# Altium schematic sheet mx8m_pmic.SchDoc (part 3 of 3)
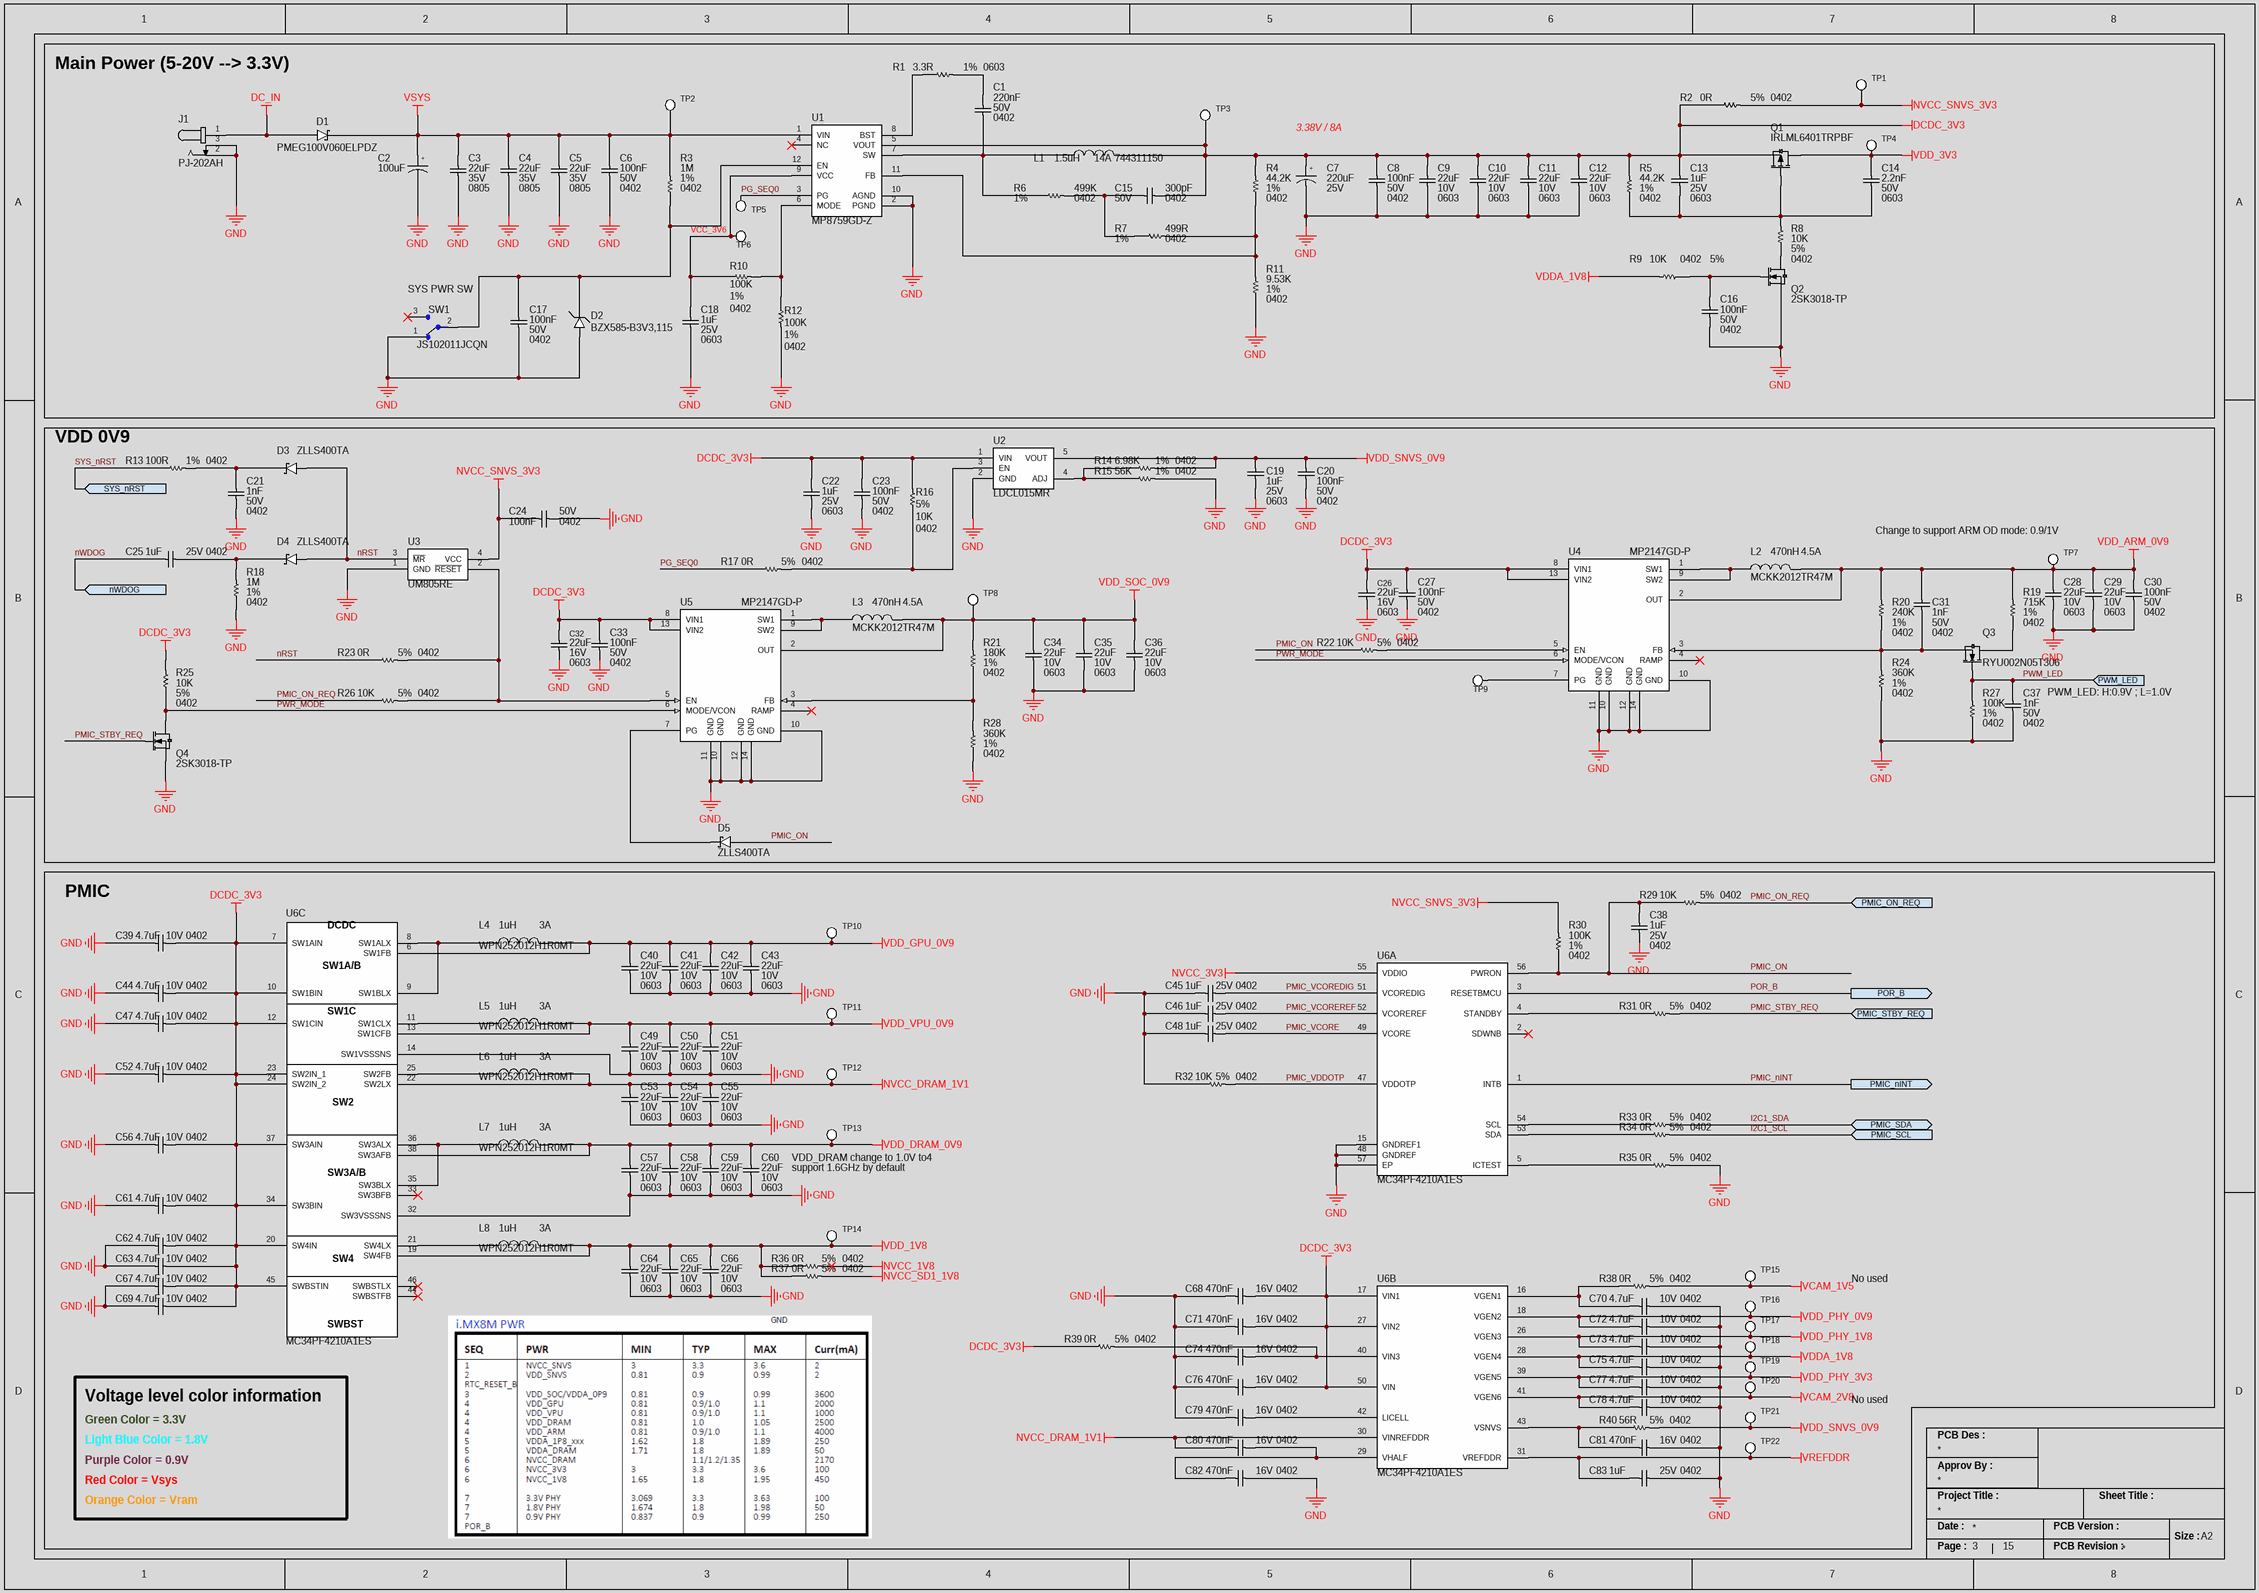
[diagram p2: mx8m_pmic.SchDoc]

## Library data of the parts (continued)
R6 = RES_499K_1%_100mW_0402: Res Thick Film 0402 499K Ohm 1% 0.1W ±100ppm/°C Molded SMD Punched Carrier T/R; Manufacturer: Panasonic; Power Rating: 100mW; Voltage Rating: 50V; Supplier 1: Digikey; Manufacturer Part Number: ERJ-2RKF4993X; RoHS: Yes; Category: Chip SMD Resistors; Stock 1: 791196; Pricing 1: 1=0.1, 10=0.024, 50=0.0152, 100=0.0125, 500=0.0084, 1000=0.0072, 5000=0.00523 (USD); Mount: Surface Mount; Number of Pins: 2; Case Code (Imperial): 0402; Case Code (Metric): 1005; Weight: 2.8E-05oz; Contact Plating: Tin; Min Operating Temperature: -55°C; Max Operating Temperature: 155°C; Packaging: Tape and Reel; Package Quantity: 1; Resistor Type: Thick Film; Termination: SMD/SMT; Number of Terminations: 2; Temperature Coefficient: 100ppm/°C; Max Power Dissipation: 100mW; Voltage Rating (DC): 50V; Features: Automotive AEC-Q200; Series: ERJ; Resistance Tolerance: 1%; Construction: Rectangular; Length: 1mm; Width: 0.5mm; Height: 0.016inch; Depth: 0.5mm; Military Standard: Not; Lead Free: Lead Free; RoHS Compliant: Yes; Reach SVHC Compliant: Unknown; ComponentLink1URL: https://datasheet.ciiva.com/5951/426256-5951322.pdf?src-supplier=Farnell; ComponentLink1Description: https://datasheet.ciiva.com/5951/426256-5951322.pdf?src-supplier=Farnell; ComponentLink2URL: https://datasheet.ciiva.com/43460/426256-43460346.pdf?src-supplier=Farnell; ComponentLink2Description: https://datasheet.ciiva.com/43460/426256-43460346.pdf?src-supplier=Farnell; ComponentLink3URL: https://datasheet.ciiva.com/9181/aoa0000ce2-9181509.pdf?src-supplier=Avnet; ComponentLink3Description: https://datasheet.ciiva.com/9181/aoa0000ce2-9181509.pdf?src-supplier=Avnet; ComponentLink4URL: https://datasheet.ciiva.com/9181/aoa0000ce2-9181513.pdf?src-supplier=Avnet; ComponentLink4Description: https://datasheet.ciiva.com/9181/aoa0000ce2-9181513.pdf?src-supplier=Avnet; ComponentLink5URL: https://datasheet.ciiva.com/16760/70260748-16760715.pdf?src-supplier=Allied+Electronics; ComponentLink5Description: https://datasheet.ciiva.com/16760/70260748-16760715.pdf?src-supplier=Allied+Electronics; ComponentLink6URL: https://datasheet.ciiva.com/28610/1678782-28610966.pdf?src-supplier=Element14; ComponentLink6Description: https://datasheet.ciiva.com/28610/1678782-28610966.pdf?src-supplier=Element14; ComponentLink7URL: https://datasheet.ciiva.com/28672/1678782-28672345.pdf?src-supplier=Element14; ComponentLink7Description: https://datasheet.ciiva.com/28672/1678782-28672345.pdf?src-supplier=Element14; ComponentLink8URL: https://datasheet.ciiva.com/46377/426256-46377753.pdf?src-supplier=Element14; ComponentLink8Description: https://datasheet.ciiva.com/46377/426256-46377753.pdf?src-supplier=Element14; Supplier Part Number 1: P499KLCT-ND
R7 = RES_499R_1%_100mW_0402: SMD Chip Resistor, 499 Ohm, ± 1%, 100 mW, 0402 [1005 Metric], Thick Film, Precision; Manufacturer: Panasonic; Power Rating: 100mW; Voltage Rating: 50V; Temperature Coefficient: 100ppm/°C; Supplier 1: Digi-Key; Manufacturer Part Number: ERJ-2RKF4990X; RoHS: Yes; Category: Chip SMD Resistors; Stock 1: 1881387; Pricing 1: 1=0.1, 10=0.024, 50=0.015, 100=0.0125, 500=0.00848, 1000=0.00731, 5000=0.00531 (USD); Mount: Surface Mount; Case Code (Metric): 1005; Case Code (Imperial): 0402; Contact Plating: Tin; Size Code: 0402; Min Operating Temperature: -55°C; Max Operating Temperature: 155°C; Packaging: Tape and Reel; Package Quantity: 1; Resistor Type: Thick Film; Number of Terminations: 2; Termination: SMD/SMT; Max Power Dissipation: 100mW; Voltage Rating (DC): 50V; Features: Automotive AEC-Q200; Series: ERJ; Resistance Tolerance: 1%; Technology: THICK FILM; Construction: Rectangular; Length: 1mm; Width: 0.5mm; Height: 0.35mm; Depth: 0.5mm; Reach SVHC Compliant: No; Lead Free: Lead Free; RoHS Compliant: Yes; Military Standard: Not; ComponentLink1URL: https://datasheet.ciiva.com/16766/70260748-16766015.pdf?src-supplier=Allied+Electronics; ComponentLink1Description: https://datasheet.ciiva.com/16766/70260748-16766015.pdf?src-supplier=Allied+Electronics; ComponentLink2URL: https://datasheet.ciiva.com/16765/70260748-16765054.pdf?src-supplier=Allied+Electronics; ComponentLink2Description: https://datasheet.ciiva.com/16765/70260748-16765054.pdf?src-supplier=Allied+Electronics; ComponentLink3URL: https://datasheet.ciiva.com/16508/aoa0000ce2-16508382.pdf?src-supplier=Future+Electronics; ComponentLink3Description: https://datasheet.ciiva.com/16508/aoa0000ce2-16508382.pdf?src-supplier=Future+Electronics; Supplier Part Number 1: P499LCT-ND
R8 R9 R16 R22 R25 R26 R29 R32 = RES_10K_5%_100mW_0402: Res Thick Film 0402 10K Ohm 5% 1/10W ±200ppm/°C Molded SMD Punched Carrier T/R; Manufacturer: Panasonic; Power Rating: 100mW; Voltage Rating: 50V; Supplier 1: Digi-Key; Manufacturer Part Number: ERJ-2GEJ103X; RoHS: Yes; Category: Chip SMD Resistors; Stock 1: 4696986; Pricing 1: 1=0.1, 10=0.021, 50=0.0132, 100=0.011, 500=0.00744, 1000=0.00639, 5000=0.00464 (USD); Mount: Surface Mount; Contact Plating: Tin; Case Code (Metric): 1005; Case Code (Imperial): 0402; Size Code: 0402; Min Operating Temperature: -55°C; Max Operating Temperature: 155°C; Temperature Coefficient: 200ppm/°C; Packaging: Cut Tape; Resistor Type: Thick Film; Package Quantity: 10000; Number of Terminations: 2; Termination: SMD/SMT; Max Power Dissipation: 100mW; Features: Automotive AEC-Q200; Series: ERJ; Resistance Tolerance: 5%; Technology: THICK FILM; Voltage Rating (DC): 50V; Length: 1mm; Width: 0.5mm; Height: 0.35mm; Depth: 0.5mm; Ratings: AEC-Q200; Radiation Hardening: No; Reach SVHC Compliant: No; RoHS Compliant: Yes; Lead Free: 5697LeadFree; ComponentLink1URL: https://datasheet.ciiva.com/27055/1935721-27055112.pdf?src-supplier=Jameco; ComponentLink1Description: https://datasheet.ciiva.com/27055/1935721-27055112.pdf?src-supplier=Jameco; ComponentLink2URL: https://datasheet.ciiva.com/11821/0900766b80f806dd-11821170.pdf?src-supplier=Rs; ComponentLink2Description: https://datasheet.ciiva.com/11821/0900766b80f806dd-11821170.pdf?src-supplier=Rs; ComponentLink3URL: https://datasheet.ciiva.com/43460/1678796-43460391.pdf?src-supplier=Farnell; ComponentLink3Description: https://datasheet.ciiva.com/43460/1678796-43460391.pdf?src-supplier=Farnell; ComponentLink4URL: https://datasheet.ciiva.com/22785/1678796-22785949.pdf?src-supplier=Farnell; ComponentLink4Description: https://datasheet.ciiva.com/22785/1678796-22785949.pdf?src-supplier=Farnell; ComponentLink5URL: https://datasheet.ciiva.com/46371/1678796-46371910.pdf?src-supplier=Element14; ComponentLink5Description: https://datasheet.ciiva.com/46371/1678796-46371910.pdf?src-supplier=Element14; ComponentLink6URL: https://datasheet.ciiva.com/28514/1678796-28514154.pdf?src-supplier=Element14; ComponentLink6Description: https://datasheet.ciiva.com/28514/1678796-28514154.pdf?src-supplier=Element14; ComponentLink7URL: https://datasheet.ciiva.com/24070/aoa0000ce1-37422-24070679.pdf?src-supplier=Mouser; ComponentLink7Description: https://datasheet.ciiva.com/24070/aoa0000ce1-37422-24070679.pdf?src-supplier=Mouser; ComponentLink8URL: https://datasheet.ciiva.com/16767/70260739-16767130.pdf?src-supplier=Allied+Electronics; ComponentLink8Description: https://datasheet.ciiva.com/16767/70260739-16767130.pdf?src-supplier=Allied+Electronics; ComponentLink9URL: https://datasheet.ciiva.com/16774/70260739-16774504.pdf?src-supplier=Allied+Electronics; ComponentLink9Description: https://datasheet.ciiva.com/16774/70260739-16774504.pdf?src-supplier=Allied+Electronics; ComponentLink10URL: https://datasheet.ciiva.com/9194/aoa0000ce1-9194140.pdf?src-supplier=Avnet; ComponentLink10Description: https://datasheet.ciiva.com/9194/aoa0000ce1-9194140.pdf?src-supplier=Avnet; Supplier Part Number 1: P10KJCT-ND
R10 R12 R27 R30 = RES_100K_1%_100mW_0402: SMD Chip Resistor, 100 kOhm, ± 1%, 63 mW, 0402 [1005 Metric], Thick Film, General Purpose; Manufacturer: Yageo; Temperature Coefficient: 100ppm/°C; Power Rating: 63mW; Voltage Rating: 50V; Supplier 1: Digi-Key; Manufacturer Part Number: RC0402FR-07100KL; RoHS: Yes; Category: Chip SMD Resistors; Stock 1: 27579413; Pricing 1: 1=0.1, 10=0.014, 50=0.0084, 100=0.007, 500=0.00464, 1000=0.00396, 5000=0.00282 (USD); Case Code (Metric): 1005; Case Code (Imperial): 0402; Min Operating Temperature: -55°C; Max Operating Temperature: 155°C; Resistor Type: Thick Film; Packaging: Tape and Reel; Package Quantity: 1; Number of Terminations: 2; Termination: SMD/SMT; Max Power Dissipation: 63mW; Features: Moisture Resistant; Series: RC; Resistance Tolerance: 1%; Construction: Rectangular; Technology: THICK FILM; Voltage Rating (AC): 50V; Length: 0.039inch; Width: 0.02inch; Height: 0.016inch; Depth: 0.5mm; Reach SVHC Compliant: No; RoHS Compliant: Yes; Lead Free: 5697LeadFree; Military Standard: Not; ComponentLink1URL: https://datasheet.ciiva.com/11819/0900766b80c66297-11819452.pdf?src-supplier=Rs; ComponentLink1Description: https://datasheet.ciiva.com/11819/0900766b80c66297-11819452.pdf?src-supplier=Rs; ComponentLink2URL: https://datasheet.ciiva.com/22747/1018594-22747509.pdf?src-supplier=Element14; ComponentLink2Description: https://datasheet.ciiva.com/22747/1018594-22747509.pdf?src-supplier=Element14; ComponentLink3URL: https://datasheet.ciiva.com/2453/pyu-r-int-thick-7-2453362.pdf?src-supplier=Digi-Key; ComponentLink3Description: https://datasheet.ciiva.com/2453/pyu-r-int-thick-7-2453362.pdf?src-supplier=Digi-Key; ComponentLink4URL: https://datasheet.ciiva.com/12667/pyu-rc0402-51-rohs-l-6-r-12667930.pdf?src-supplier=Mouser; ComponentLink4Description: https://datasheet.ciiva.com/12667/pyu-rc0402-51-rohs-l-6-r-12667930.pdf?src-supplier=Mouser; ComponentLink5URL: https://datasheet.ciiva.com/15189/getdatasheetpartid-323696-15189334.pdf?src-supplier=Verical; ComponentLink5Description: https://datasheet.ciiva.com/15189/getdatasheetpartid-323696-15189334.pdf?src-supplier=Verical; ComponentLink6URL: https://datasheet.ciiva.com/2453/pyu-r-int-thick-7-2453363.pdf?src-supplier=Digi-Key; ComponentLink6Description: https://datasheet.ciiva.com/2453/pyu-r-int-thick-7-2453363.pdf?src-supplier=Digi-Key; ComponentLink7URL: https://datasheet.ciiva.com/2453/pyu-r-int-thick-7-2453361.pdf?src-supplier=Digi-Key; ComponentLink7Description: https://datasheet.ciiva.com/2453/pyu-r-int-thick-7-2453361.pdf?src-supplier=Digi-Key; Supplier Part Number 1: 311-100KLRCT-ND
R11 = RES_9.53K_1%_100mW_0402: Res Thick Film 0402 9.53K Ohm 1% 1/10W ±100ppm/°C Molded SMD Punched Carrier T/R; Manufacturer: Panasonic; Power Rating: 100mW; Voltage Rating: 50V; Supplier 1: Digikey; Manufacturer Part Number: ERJ-2RKF9531X; RoHS: Yes; Category: Chip SMD Resistors; Stock 1: 73665; Pricing 1: 1=0.1, 10=0.024, 50=0.0152, 100=0.0125, 500=0.0084, 1000=0.0072, 5000=0.00523 (USD); Mount: Surface Mount; Case Code (Metric): 1005; Case Code (Imperial): 0402; Contact Plating: Tin; Min Operating Temperature: -55°C; Max Operating Temperature: 155°C; Packaging: Tape and Reel; Package Quantity: 10000; Resistor Type: Thick Film; Number of Terminations: 2; Termination: SMD/SMT; Temperature Coefficient: 100ppm/°C; Max Power Dissipation: 100mW; Voltage Rating (DC): 50V; Series: ERJ; Resistance Tolerance: 1%; Technology: THICK FILM; Features: Automotive AEC-Q200; Length: 1mm; Width: 0.5mm; Height: 0.35mm; Depth: 0.5mm; Ratings: AEC-Q200; Reach SVHC Compliant: Yes; Lead Free: Lead Free; RoHS Compliant: Yes; ComponentLink1URL: https://datasheet.ciiva.com/22764/1678782-22764822.pdf?src-supplier=Farnell; ComponentLink1Description: https://datasheet.ciiva.com/22764/1678782-22764822.pdf?src-supplier=Farnell; ComponentLink2URL: https://datasheet.ciiva.com/43467/1678782-43467400.pdf?src-supplier=Farnell; ComponentLink2Description: https://datasheet.ciiva.com/43467/1678782-43467400.pdf?src-supplier=Farnell; ComponentLink3URL: https://datasheet.ciiva.com/9194/aoa0000ce2-9194143.pdf?src-supplier=Avnet; ComponentLink3Description: https://datasheet.ciiva.com/9194/aoa0000ce2-9194143.pdf?src-supplier=Avnet; ComponentLink4URL: https://datasheet.ciiva.com/9194/aoa0000ce2-9194153.pdf?src-supplier=Avnet; ComponentLink4Description: https://datasheet.ciiva.com/9194/aoa0000ce2-9194153.pdf?src-supplier=Avnet; ComponentLink5URL: https://datasheet.ciiva.com/24026/aoa0000ce2-24026718.pdf?src-supplier=Mouser; ComponentLink5Description: https://datasheet.ciiva.com/24026/aoa0000ce2-24026718.pdf?src-supplier=Mouser; ComponentLink6URL: https://datasheet.ciiva.com/7829/1678782-7829317.pdf?src-supplier=Element14; ComponentLink6Description: https://datasheet.ciiva.com/7829/1678782-7829317.pdf?src-supplier=Element14; ComponentLink7URL: https://datasheet.ciiva.com/22668/1678782-22668670.pdf?src-supplier=Element14; ComponentLink7Description: https://datasheet.ciiva.com/22668/1678782-22668670.pdf?src-supplier=Element14; ComponentLink8URL: https://datasheet.ciiva.com/46373/1678782-46373013.pdf?src-supplier=Element14; ComponentLink8Description: https://datasheet.ciiva.com/46373/1678782-46373013.pdf?src-supplier=Element14; ComponentLink9URL: https://datasheet.ciiva.com/46373/1678782-46373014.pdf?src-supplier=Element14; ComponentLink9Description: https://datasheet.ciiva.com/46373/1678782-46373014.pdf?src-supplier=Element14; ComponentLink10URL: https://datasheet.ciiva.com/16786/70260748-16786262.pdf?src-supplier=Allied+Electronics; ComponentLink10Description: https://datasheet.ciiva.com/16786/70260748-16786262.pdf?src-supplier=Allied+Electronics; ComponentLink11URL: https://datasheet.ciiva.com/16788/70260748-16788696.pdf?src-supplier=Allied+Electronics; ComponentLink11Description: https://datasheet.ciiva.com/16788/70260748-16788696.pdf?src-supplier=Allied+Electronics; Supplier Part Number 1: P9.53KLDKR-ND
R13 = RES_100R_1%_100mW_0402: Resistor Thick Film 0402 100 Ohm 1% 1/10W 100ppm/C Molded SMD Punched Carrier T/R; Manufacturer: Panasonic; Temperature Coefficient: 100ppm/°C; Power Rating: 100mW; Voltage Rating: 50V; Supplier 1: Mouser; Manufacturer Part Number: ERJ-2RKF1000X; RoHS: Yes; Category: Chip SMD Resistors; Stock 1: 10699571; Pricing 1: 1=0.1, 10=0.015, 50=0.015, 100=0.009, 1000=0.006, 10000=0.004 (USD); Mount: Surface Mount; Number of Pins: 2; Contact Plating: Tin; Case Code (Imperial): 0402; Case Code (Metric): 1005; Size Code: 0402; Min Operating Temperature: -55°C; Max Operating Temperature: 155°C; Resistor Type: Thick Film; Packaging: Tape and Reel; Package Quantity: 1; Termination: SMD/SMT; Number of Terminations: 2; Max Power Dissipation: 100mW; Voltage Rating (DC): 50V; Features: Automotive AEC-Q200; Series: ERJ; Technology: THICK FILM; Resistance Tolerance: 1%; Construction: Rectangular; Length: 1mm; Width: 0.5mm; Height: 0.35mm; Depth: 0.5mm; Radiation Hardening: No; Reach SVHC Compliant: No; Military Standard: Not; Lead Free: Lead Free; RoHS Compliant: Yes; ComponentLink1URL: https://datasheet.ciiva.com/27056/2007311-27056035.pdf?src-supplier=Jameco; ComponentLink1Description: https://datasheet.ciiva.com/27056/2007311-27056035.pdf?src-supplier=Jameco; ComponentLink2URL: https://datasheet.ciiva.com/11821/0900766b80f80784-11821173.pdf?src-supplier=Rs; ComponentLink2Description: https://datasheet.ciiva.com/11821/0900766b80f80784-11821173.pdf?src-supplier=Rs; ComponentLink3URL: https://datasheet.ciiva.com/7830/426256-7830973.pdf?src-supplier=Element14; ComponentLink3Description: https://datasheet.ciiva.com/7830/426256-7830973.pdf?src-supplier=Element14; ComponentLink4URL: https://datasheet.ciiva.com/43467/1678782-43467223.pdf?src-supplier=Farnell; ComponentLink4Description: https://datasheet.ciiva.com/43467/1678782-43467223.pdf?src-supplier=Farnell; ComponentLink5URL: https://datasheet.ciiva.com/28514/1678782-28514175.pdf?src-supplier=Element14; ComponentLink5Description: https://datasheet.ciiva.com/28514/1678782-28514175.pdf?src-supplier=Element14; ComponentLink6URL: https://datasheet.ciiva.com/46372/1678782-46372741.pdf?src-supplier=Element14; ComponentLink6Description: https://datasheet.ciiva.com/46372/1678782-46372741.pdf?src-supplier=Element14; ComponentLink7URL: https://datasheet.ciiva.com/16776/70260748-16776427.pdf?src-supplier=Allied+Electronics; ComponentLink7Description: https://datasheet.ciiva.com/16776/70260748-16776427.pdf?src-supplier=Allied+Electronics; ComponentLink8URL: https://datasheet.ciiva.com/9186/aoa0000ce2-9186683.pdf?src-supplier=Avnet; ComponentLink8Description: https://datasheet.ciiva.com/9186/aoa0000ce2-9186683.pdf?src-supplier=Avnet; ComponentLink9URL: https://datasheet.ciiva.com/16199/aoa0000ce2-16199575.pdf?src-supplier=Future+Electronics; ComponentLink9Description: https://datasheet.ciiva.com/16199/aoa0000ce2-16199575.pdf?src-supplier=Future+Electronics; ComponentLink10URL: https://datasheet.ciiva.com/48531/aoa0000ce2-48531067.pdf?src-supplier=Avnet; ComponentLink10Description: https://datasheet.ciiva.com/48531/aoa0000ce2-48531067.pdf?src-supplier=Avnet; ComponentLink11URL: https://datasheet.ciiva.com/30260/aoa0000ce2-30260809.pdf?src-supplier=Onlinecomponents.com; ComponentLink11Description: https://datasheet.ciiva.com/30260/aoa0000ce2-30260809.pdf?src-supplier=Onlinecomponents.com; Supplier Part Number 1: 667-ERJ-2RKF1000X
R14 = RES_6.98K_1%_63mW_0402: SMD Chip Resistor, 6.98 kOhm, ± 1%, 63 mW, 0402 [1005 Metric], Thick Film, General Purpose; Manufacturer: Yageo; Temperature Coefficient: 100ppm/°C; Power Rating: 62.5mW; Voltage Rating: 50V; Max Power Dissipation: 63mW; Supplier 1: Digi-Key; Manufacturer Part Number: RC0402FR-076K98L; RoHS: Yes; Category: Chip SMD Resistors; Stock 1: 762475; Pricing 1: 1=0.1, 10=0.014, 50=0.0084, 100=0.007, 500=0.00464, 1000=0.00396, 5000=0.00282 (USD); Contact Plating: Tin,Matte; Case Code (Imperial): 0402; Case Code (Metric): 1005; Size Code: 0402; Min Operating Temperature: -55°C; Max Operating Temperature: 155°C; Packaging: Tape and Reel; Number of Terminations: 2; Termination: SMD/SMT; Voltage Rating (DC): 50V; Features: Moisture Resistant; Series: RC; Length: 0.039inch; Width: 0.5mm; Height: 0.016inch; Lead Free: Lead Free; RoHS Compliant: Yes; ComponentLink1URL: https://datasheet.ciiva.com/8892/pyu-rc0402-51-rohs-l-6-8892045.pdf?src-supplier=Avnet; ComponentLink1Description: https://datasheet.ciiva.com/8892/pyu-rc0402-51-rohs-l-6-8892045.pdf?src-supplier=Avnet; ComponentLink2URL: https://datasheet.ciiva.com/12558/pyu-rc0402-51-rohs-l-6-r-8721-12558877.pdf?src-supplier=Mouser; ComponentLink2Description: https://datasheet.ciiva.com/12558/pyu-rc0402-51-rohs-l-6-r-8721-12558877.pdf?src-supplier=Mouser; ComponentLink3URL: https://datasheet.ciiva.com/17196/pyu-rc0402-51-rohs-l-6-r-17196136.pdf?src-supplier=Future+Electronics; ComponentLink3Description: https://datasheet.ciiva.com/17196/pyu-rc0402-51-rohs-l-6-r-17196136.pdf?src-supplier=Future+Electronics; Supplier Part Number 1: YAG3220CT-ND
R15 = RES_56K_1%_100mW_0402: Res Thick Film 0402 56K Ohm 1% 0.1W(1/10W) ±100ppm/C Pad SMD Automotive T/R; Manufacturer: KOA Speer; Power Rating: 63mW; Voltage Rating: 50V; Temperature Coefficient: 100ppm/°C; Max Power Dissipation: 100mW; Supplier 1: Digi-Key; Manufacturer Part Number: RK73H1ETTP5602F; RoHS: Yes; Category: Chip SMD Resistors; Stock 1: 128205; Pricing 1: 1=0.1, 10=0.021, 50=0.0134, 100=0.0112, 500=0.00764, 1000=0.00658, 5000=0.00478 (USD); Case Code (Imperial): 0402; Case Code (Metric): 1005; Min Operating Temperature: -55°C; Max Operating Temperature: 155°C; Packaging: Tape and Reel; Termination: SMD/SMT; Series: RK73H; Construction: Rectangular; Features: Moisture Resistant,Automotive AEC-Q200; Number of Terminations: 2; Length: 1mm; Depth: 0.5mm; Ratings: AEC-Q200; Military Standard: Not; Lead Free: Lead Free; RoHS Compliant: Yes; ComponentLink1URL: https://datasheet.ciiva.com/5557/rk73h-5557274.pdf?src-supplier=Mouser; ComponentLink1Description: https://datasheet.ciiva.com/5557/rk73h-5557274.pdf?src-supplier=Mouser; Supplier Part Number 1: 2019-RK73H1ETTP5602FDKR-ND
R19 = RES_715K_1%_100mW_0402: Res Thick Film 0402 715K Ohm 1% 0.1W(1/10W) ±100ppm/C Pad SMD Automotive T/R; Manufacturer: KOA Speer; Power Rating: 63mW; Voltage Rating: 50V; Temperature Coefficient: 100ppm/°C; Supplier 1: Digi-Key; Manufacturer Part Number: RK73H1ETTP7153F; RoHS: Yes; Category: Chip SMD Resistors; Stock 1: 50316; Pricing 1: 1=0.1, 10=0.021, 50=0.0134, 100=0.0112, 500=0.00764, 1000=0.00658, 5000=0.00478 (USD); Case Code (Imperial): 0402; Case Code (Metric): 1005; Min Operating Temperature: -55°C; Max Operating Temperature: 155°C; Packaging: Tape and Reel; Package Quantity: 10000; Termination: SMD/SMT; Voltage Rating (DC): 50V; Series: RK73H; Construction: Rectangular; Length: 1mm; Width: 0.5mm; Height: 0.35mm; Depth: 0.5mm; Military Standard: Not; Lead Free: Lead Free; RoHS Compliant: Yes; ComponentLink1URL: https://datasheet.ciiva.com/5553/rk73h-5553480.pdf?src-supplier=Mouser; ComponentLink1Description: https://datasheet.ciiva.com/5553/rk73h-5553480.pdf?src-supplier=Mouser; Supplier Part Number 1: 2019-RK73H1ETTP7153FCT-ND
R20 = RES_240K_1%_63mW_0402: SMD Chip Resistor, 240 kOhm, ± 1%, 63 mW, 0402 [1005 Metric], Thick Film, General Purpose; Manufacturer: Bourns; Power Rating: 62.5mW; Voltage Rating: 50V; Temperature Coefficient: 100ppm/°C; Max Power Dissipation: 63mW; Supplier 1: Digi-Key; Manufacturer Part Number: CR0402-FX-2403GLF; RoHS: Yes; Category: Chip SMD Resistors; Stock 1: 42462; Pricing 1: 1=0.1, 10=0.014, 50=0.0076, 100=0.0061, 500=0.0039, 1000=0.00327, 5000=0.00226 (USD); Mount: Surface Mount; Case Code (Imperial): 0402; Case Code (Metric): 1005; Contact Plating: Tin; Min Operating Temperature: -55°C; Max Operating Temperature: 125°C; Packaging: Tape and Reel; Package Quantity: 10000; Termination: SMD/SMT; Series: CR0402; Number of Terminations: 2; Length: 1mm; Width: 0.5mm; Height: 0.35mm; Thickness: 356um; Radiation Hardening: No; RoHS Compliant: Yes; ComponentLink1URL: https://datasheet.ciiva.com/9120/cr0402-9120153.pdf?src-supplier=Avnet; ComponentLink1Description: https://datasheet.ciiva.com/9120/cr0402-9120153.pdf?src-supplier=Avnet; Supplier Part Number 1: CR0402-FX-2403GLFCT-ND
R21 = RES_180K_1%_100mW_0402: Res Thick Film 0402 180K Ohm 1% 0.1W(1/10W) ±100ppm/C Pad SMD Automotive T/R; Manufacturer: KOA Speer; Power Rating: 63mW; Voltage Rating: 50V; Temperature Coefficient: 100ppm/°C; Supplier 1: Digi-Key; Manufacturer Part Number: RK73H1ETTP1803F; RoHS: Yes; Category: Chip SMD Resistors; Stock 1: 58402; Pricing 1: 1=0.1, 10=0.021, 50=0.0134, 100=0.0112, 500=0.00764, 1000=0.00658, 5000=0.00478 (USD); Case Code (Imperial): 0402; Case Code (Metric): 1005; Min Operating Temperature: -55°C; Max Operating Temperature: 155°C; Packaging: Tape and Reel; Termination: SMD/SMT; Voltage Rating (DC): 50V; Series: RK73H; Construction: Rectangular; Length: 1mm; Depth: 0.5mm; Military Standard: Not; Lead Free: Lead Free; RoHS Compliant: Yes; ComponentLink1URL: https://datasheet.ciiva.com/5553/rk73h-5553742.pdf?src-supplier=Mouser; ComponentLink1Description: https://datasheet.ciiva.com/5553/rk73h-5553742.pdf?src-supplier=Mouser; Supplier Part Number 1: 2019-RK73H1ETTP1803FCT-ND
R24 R28 = RES_360K_1%_100mW_0402: Res Thick Film 0402 360K Ohm 1% 0.1W(1/10W) ±100ppm/C Pad SMD Automotive T/R; Manufacturer: KOA Speer; Power Rating: 63mW; Supplier 1: Digi-Key; Manufacturer Part Number: RK73H1ETTP3603F; RoHS: Yes; Category: Chip SMD Resistors; Stock 1: 48950; Pricing 1: 1=0.1, 10=0.021, 50=0.0134, 100=0.0112, 500=0.00764, 1000=0.00658, 5000=0.00478 (USD); Min Operating Temperature: -55°C; Max Operating Temperature: 155°C; Construction: Rectangular; Length: 1mm; Depth: 0.5mm; Military Standard: Not; Lead Free: Lead Free; RoHS Compliant: Yes; Supplier Part Number 1: 2019-RK73H1ETTP3603FCT-ND
R40 = RES_56R_5%_63mW_0402: SMD Chip Resistor, 56 Ohm, ± 5%, 63 mW, 0402 [1005 Metric], Thick Film, General Purpose; Manufacturer: Vishay Dale; Power Rating: 63mW; Voltage Rating: 50V; Temperature Coefficient: 200ppm/°C; Supplier 1: Digi-Key; Manufacturer Part Number: CRCW040256R0JNED; RoHS: Yes; Category: Chip SMD Resistors; Stock 1: 34516; Pricing 1: 1=0.1, 10=0.024, 50=0.015, 100=0.0125, 500=0.00848, 1000=0.00731, 5000=0.00531 (USD); Case Code (Metric): 1005; Case Code (Imperial): 0402; Weight: 2.3E-05oz; Contact Plating: Tin; Size Code: 0402; Min Operating Temperature: -55°C; Max Operating Temperature: 155°C; Packaging: Tape and Reel; Package Quantity: 10000; Resistor Type: Thick Film; Number of Terminations: 2; Max Power Dissipation: 63mW; Voltage Rating (DC): 50V; Features: Automotive AEC-Q200; Series: CRCW; Resistance Tolerance: 5%; Termination: SMD/SMT; Technology: THICK FILM; Length: 1mm; Width: 0.5mm; Height: 0.35mm; Depth: 0.5mm; Ratings: AEC-Q200; Radiation Hardening: No; RoHS Compliant: Yes; Lead Free: Lead Free; Reach SVHC Compliant: Unknown; ComponentLink1URL: https://datasheet.ciiva.com/2462/dcrcwe3-2462223.pdf?src-supplier=Digi-Key; ComponentLink1Description: https://datasheet.ciiva.com/2462/dcrcwe3-2462223.pdf?src-supplier=Digi-Key; ComponentLink2URL: https://datasheet.ciiva.com/2462/dcrcwe3-2462224.pdf?src-supplier=Digi-Key; ComponentLink2Description: https://datasheet.ciiva.com/2462/dcrcwe3-2462224.pdf?src-supplier=Digi-Key; ComponentLink3URL: https://datasheet.ciiva.com/2462/dcrcwe3-2462225.pdf?src-supplier=Digi-Key; ComponentLink3Description: https://datasheet.ciiva.com/2462/dcrcwe3-2462225.pdf?src-supplier=Digi-Key; ComponentLink4URL: https://datasheet.ciiva.com/16787/70201119-16787145.pdf?src-supplier=Allied+Electronics; ComponentLink4Description: https://datasheet.ciiva.com/16787/70201119-16787145.pdf?src-supplier=Allied+Electronics; ComponentLink5URL: https://datasheet.ciiva.com/5542/dcrcwe3-109170-5542906.pdf?src-supplier=Mouser; ComponentLink5Description: https://datasheet.ciiva.com/5542/dcrcwe3-109170-5542906.pdf?src-supplier=Mouser; ComponentLink6URL: https://datasheet.ciiva.com/8341/dcrcwe3-8341309.pdf?src-supplier=Avnet; ComponentLink6Description: https://datasheet.ciiva.com/8341/dcrcwe3-8341309.pdf?src-supplier=Avnet; ComponentLink7URL: https://datasheet.ciiva.com/3256/dcrcwe3-3256661.pdf?src-supplier=Avnet; ComponentLink7Description: https://datasheet.ciiva.com/3256/dcrcwe3-3256661.pdf?src-supplier=Avnet; Supplier Part Number 1: 541-56JCT-ND
SW1 = SWITCH_SPDT_300mA_6V_JS102011JCQN: SWITCH SLIDE SPDT 300MA 6V; Manufacturer: ITT C&K; Actuator Material: Nylon,Polyamide,PA46; Switch Function: On-On; Actuator Type: Standard; Switch Travel: 2mm; Electrical Life: 5000Cycles; Supplier 1: Digikey; Manufacturer Part Number: JS102011JCQN; RoHS: Yes; Category: Slide Switches; Stock 1: 40877; Pricing 1: 1=0.94, 10=0.903, 25=0.8444, 100=0.7331, 250=0.66708, 500=0.61844 (USD); Mount: Surface Mount; Contact Material: Copper Alloy; Contact Plating: Silver; Min Operating Temperature: -40°C; Max Operating Temperature: 85°C; Throw Configuration: SPDT; Packaging: Cut Tape; Voltage Rating (DC): 6V; Series: JS; Actuator Length: 2mm; ComponentLink1URL: http://www.farnell.com/datasheets/2674788.pdf?src-supplier=Farnell; ComponentLink1Description: http://www.farnell.com/datasheets/2674788.pdf?src-supplier=Farnell; ComponentLink2URL: http://www.farnell.com/datasheets/2674788.pdf?src-supplier=Element14; ComponentLink2Description: http://www.farnell.com/datasheets/2674788.pdf?src-supplier=Element14; ComponentLink3URL: https://datasheet.octopart.com/JS102011JCQN-C%26K-Components-datasheet-67873653.pdf?src-supplier=Newark; ComponentLink3Description: https://datasheet.octopart.com/JS102011JCQN-C%26K-Components-datasheet-67873653.pdf?src-supplier=Newark; ComponentLink4URL: http://www.farnell.com/datasheets/2674788.pdf?src-supplier=Newark; ComponentLink4Description: http://www.farnell.com/datasheets/2674788.pdf?src-supplier=Newark; ComponentLink5URL: https://www.ckswitches.com/media/1422/js.pdf?src-supplier=Digikey; ComponentLink5Description: https://www.ckswitches.com/media/1422/js.pdf?src-supplier=Digikey; ComponentLink6URL: https://datasheet.octopart.com/JS102011JCQN-C%26K-Components-datasheet-138126065.pdf?src-supplier=TME; ComponentLink6Description: https://datasheet.octopart.com/JS102011JCQN-C%26K-Components-datasheet-138126065.pdf?src-supplier=TME; Supplier Part Number 1: CKN10721CT-ND
TP1-TP22 = TP_PAD_SMD_Round: Test Point, SMD pad, round, 1.5mm, 1.6mm, 3mm diameter
U1 = IC_REG_BUCK_26V_8A_MP8759GD-Z: Tape & Reel (TR) Active Step-Down Buck DC to DC switching regulator 26V 8A 700kHz -40C~125C TJ; Manufacturer: Monolithic Power Systems; Output Voltage: 600mV; Number of Outputs: 1; Min Input Voltage: 4.5V; Max Output Current: 10A; Output Type: Adjustable; Supplier 1: Digi-Key; Manufacturer Part Number: MP8759GD-Z; RoHS: Yes; Category: Voltage Regulators - Switching; Stock 1: 455; Pricing 1: 1=2.71, 10=2.436, 25=2.2976, 100=1.9577, 250=1.8382, 500=1.60842, 1000=1.3327, 2500=1.24078 (USD); Mount: Surface Mount; Case/Package: QFN; Number of Pins: 14; Contact Plating: Tin,Matte; Min Operating Temperature: -40°C; Max Operating Temperature: 125°C; Max Input Voltage: 26V; Switching Frequency: 700kHz; Operating Supply Voltage: 26V; RoHS Compliant: Yes; ComponentLink1URL: https://www.monolithicpower.com/pub/media/document/MP8759_r1.1.pdf?src-supplier=Digi-Key; ComponentLink1Description: https://www.monolithicpower.com/pub/media/document/MP8759_r1.1.pdf?src-supplier=Digi-Key; ComponentLink2URL: https://datasheet.octopart.com/MP8759GD-Z-Monolithic-Power-Systems-datasheet-104200629.pdf?src-supplier=SHENGYU+ELECTRONICS; ComponentLink2Description: https://datasheet.octopart.com/MP8759GD-Z-Monolithic-Power-Systems-datasheet-104200629.pdf?src-supplier=SHENGYU+ELECTRONICS; ComponentLink3URL: https://datasheet.octopart.com/MP8759GD-Z-Monolithic-Power-Systems-datasheet-155982220.pdf?src-supplier=Monolithic+Power+Systems; ComponentLink3Description: https://datasheet.octopart.com/MP8759GD-Z-Monolithic-Power-Systems-datasheet-155982220.pdf?src-supplier=Monolithic+Power+Systems; Supplier Part Number 1: 1589-1736-1-ND
U2 = IC_REG_LDO_5.5V_0.15A_LDCL015MR: LDO Regulator Pos 0.8V to 5.5V 0.15A 5-Pin SOT-23 T/R; Manufacturer: STMicroelectronics; Output Voltage: 800mV; Min Input Voltage: 1.8V; Max Output Current: 150mA; Number of Outputs: 1; Polarity: Positive; Quiescent Current: 160uA; Accuracy: 2%; Output Type: Adjustable; Dropout Voltage: 50mV; Max Output Voltage: 5.4V; Power Supply Rejection Ratio (PSRR): 51dB; Supplier 1: Digi-Key; Manufacturer Part Number: LDCL015MR; RoHS: Yes; Category: Voltage Regulators - Linear; Stock 1: 49636; Pricing 1: 1=1.51, 10=1.351, 25=1.282, 100=1.0532, 250=0.98452, 500=0.87004, 1000=0.68688 (USD); Mount: Surface Mount; Case/Package: SOT-23; Number of Pins: 5; Min Operating Temperature: -40°C; Max Operating Temperature: 125°C; Max Input Voltage: 5.5V; Output Current: 150mA; Packaging: Tape and Reel; Number of Regulators: 1; Min Output Voltage: 800mV; Reference Voltage: 800mV; Series: -; Output Configuration: Positive; Length: 2.95mm; Width: 1.6mm; Height: 1.3mm; Reach SVHC Compliant: No; Lead Free: Lead Free; RoHS Compliant: Yes; ComponentLink1URL: https://datasheet.ciiva.com/22651/1827871-22651045.pdf?src-supplier=Element14; ComponentLink1Description: https://datasheet.ciiva.com/22651/1827871-22651045.pdf?src-supplier=Element14; ComponentLink2URL: https://datasheet.ciiva.com/4885/dm00037343-99499-4885392.pdf?src-supplier=Mouser; ComponentLink2Description: https://datasheet.ciiva.com/4885/dm00037343-99499-4885392.pdf?src-supplier=Mouser; ComponentLink3URL: https://datasheet.ciiva.com/41439/001184664-da-01-en-ic-reg-ldo-adj-0-ldcl015mr-sot-23-5-stm-41439787.pdf?src-supplier=Conrad; ComponentLink3Description: https://datasheet.ciiva.com/41439/001184664-da-01-en-ic-reg-ldo-adj-0-ldcl015mr-sot-23-5-stm-41439787.pdf?src-supplier=Conrad; ComponentLink4URL: https://datasheet.ciiva.com/2045/dm00037343-2045558.pdf?src-supplier=Digi-Key; ComponentLink4Description: https://datasheet.ciiva.com/2045/dm00037343-2045558.pdf?src-supplier=Digi-Key; ComponentLink5URL: https://datasheet.ciiva.com/2045/dm00037343-2045559.pdf?src-supplier=Digi-Key; ComponentLink5Description: https://datasheet.ciiva.com/2045/dm00037343-2045559.pdf?src-supplier=Digi-Key; ComponentLink6URL: https://datasheet.ciiva.com/2045/dm00037343-2045560.pdf?src-supplier=Digi-Key; ComponentLink6Description: https://datasheet.ciiva.com/2045/dm00037343-2045560.pdf?src-supplier=Digi-Key; Supplier Part Number 1: 497-12085-1-ND
U3 = IC_VOLTAGE_SUPERVISOR_UM805RE: Supervisor Open Drain or Open Collector 1 Channel SOT-143; Manufacturer: Union Semiconductor International Limited; Manufacturer Part Number: UM805RE; ComponentLink1Description: Suplier link; ComponentLink1URL: https://www.digikey.com/en/products/detail/union-semiconductor-international-limited/UM805RE/21265144?s=N4IgTCBcDaIKoFkAcAGArAJQKIgLoF8g; Category: Integrated Circuit
U4 U5 = IC_REG_BUCK_0V9_4A_MP2147GD-P: IC Reg Buck Adjustable 4A 12QFN; Manufacturer: Monolithic Power Systems; Number of Outputs: 1; Output Voltage: 5.5V; Min Input Voltage: 2.8V; Min Output Voltage: 600mV; Switching Frequency: 1.2MHz; Synchronous Rectifier: Yes; Operating Supply Current: 40uA; Output Configuration: Positive; Supplier 1: Digi-Key; Manufacturer Part Number: MP2147GD-P; RoHS: Yes; Category: Voltage Regulators - Switching; Stock 1: 1866; Pricing 1: 1=5.09, 10=4.567, 25=4.3176, 100=3.742, 250=3.55016 (USD); Mount: Surface Mount; Case/Package: QFN; Number of Pins: 12; Weight: 0.000776oz; Min Operating Temperature: -40°C; Max Operating Temperature: 125°C; Packaging: Tape and Reel; Package Quantity: 500; Series: -; Max Output Current: 4A; Max Input Voltage: 5.5V; Max Output Voltage: 5.5V; Output Current: 4A; Operating Supply Voltage: 5.5V; Output Type: Adjustable; Radiation Hardening: No; ComponentLink1URL: http://www.mouser.com/ds/2/277/MP2147_r1.1-523188.pdf?src-supplier=Mouser; ComponentLink1Description: http://www.mouser.com/ds/2/277/MP2147_r1.1-523188.pdf?src-supplier=Mouser; ComponentLink2URL: https://www.monolithicpower.com/pub/media/document/MP2147_r1.1.pdf?src-supplier=Digi-Key; ComponentLink2Description: https://www.monolithicpower.com/pub/media/document/MP2147_r1.1.pdf?src-supplier=Digi-Key; ComponentLink3URL: http://www.monolithicpower.com/DesktopModules/DocumentManage/API/Document/GetDocument?id=2970&src-supplier=Avnet; ComponentLink3Description: http://www.monolithicpower.com/DesktopModules/DocumentManage/API/Document/GetDocument?id=2970&src-supplier=Avnet; ComponentLink4URL: https://datasheet.octopart.com/MP2147GD-P-Monolithic-Power-Systems-datasheet-155982077.pdf?src-supplier=Monolithic+Power+Systems; ComponentLink4Description: https://datasheet.octopart.com/MP2147GD-P-Monolithic-Power-Systems-datasheet-155982077.pdf?src-supplier=Monolithic+Power+Systems; Supplier Part Number 1: 1589-MP2147GD-PCT-ND
U6 = IC_PMIC_NXP_MC34PF4210A1ES: Step Up DC-DC Converter with LDO Regulator 13-OUT 56-Pin QFN Tray; Manufacturer: NXP Semiconductors; Supplier 1: Mouser; Manufacturer Part Number: MC34PF4210A1ES; RoHS: Yes; Category: Power Management ICs; Stock 1: 24; Pricing 1: 1=10.48, 10=9.47, 25=8.72, 50=8.72, 100=7.87, 260=7.34, 520=6.84, 1000=6.84, 1040=6.18, 10000=6.18 (USD); RoHS Compliant: Yes; Supplier Part Number 1: 771-MC34PF4210A1ES